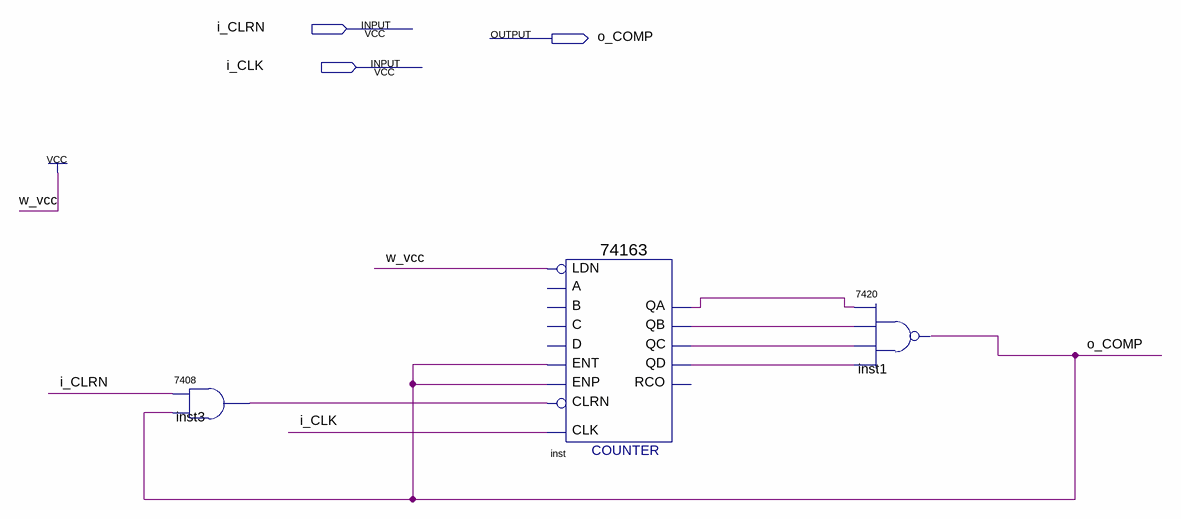
[diagram p0: schematic sheet]
// Quartus schematic counter_15.bdf as structural Verilog: 3 symbols, 3 pins
module counter_15 (
  input  i_CLRN,
  input  i_CLK,
  output o_COMP
);

  wire inst3_1, inst_qa, inst_qb, inst_qc, inst_qd;

  \7408  inst3 (.\3 (o_COMP), .\2 (i_CLRN), .\1 (inst3_1));
  \74163  inst (
    .ENT(o_COMP), .CLRN(inst3_1), .CLK(i_CLK), .ENP(o_COMP), .LDN(1'b1), .QA(inst_qa), .QB(inst_qb),
    .QC(inst_qc), .QD(inst_qd));  // open: C, B, A, D, RCO
  \7420  inst1 (.\4 (inst_qc), .\2 (inst_qa), .\3 (inst_qb), .\5 (inst_qd), .\1 (o_COMP));
endmodule
